# EAGLE schematic ESD_FINAL_SCHEMATICS2 (EAGLE 9.5.0)
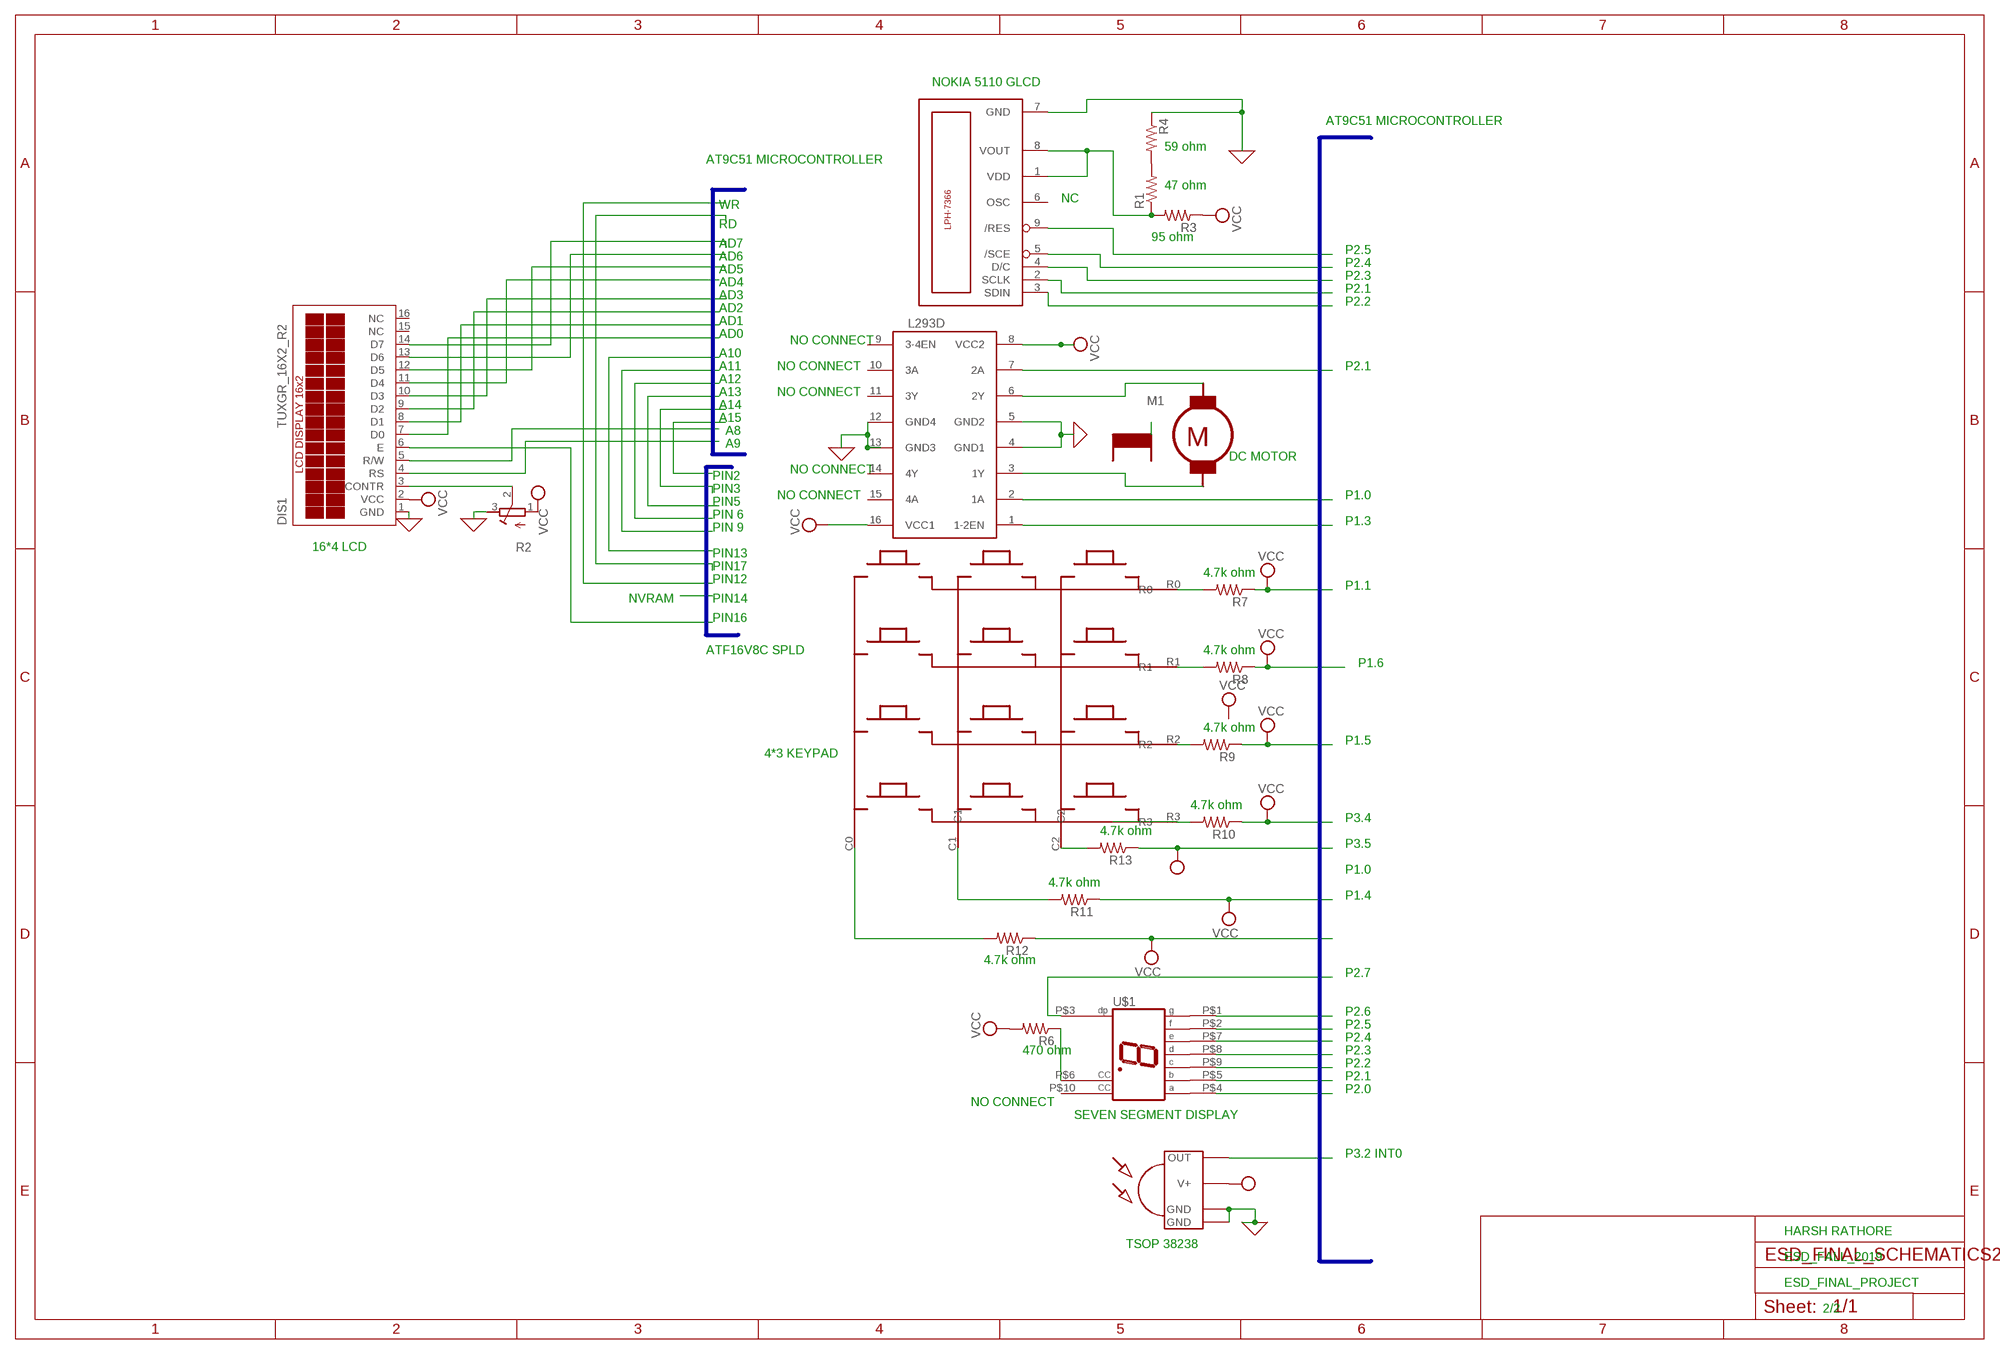
[diagram p0: schematic, sheet 1]

## Parts
DIS1  TUXGR_16X2_R2  [TUXGR_16X2_R2]
IC1  L293D  [DIL16]
KP1  KEYPAD  [KEYPAD]
LCD3  LPH-7366  [LPH-7366]
M1  MOTOR_DC_2_XL  [4PIN]
R1  R-US_0204/2V  [0204V]
R2  R-TRIMM4G/J  [RTRIM4G/J]
R3  R-US_0204/2V  [0204V]
R4  R-US_0204/2V  [0204V]
R6  R-US_0204/2V  [0204V]
R7  R-US_0204/2V  [0204V]
R8  R-US_0204/2V  [0204V]
R9  R-US_0204/2V  [0204V]
R10  R-US_0204/2V  [0204V]
R11  R-US_0204/2V  [0204V]
R12  R-US_0204/2V  [0204V]
R13  R-US_0204/2V  [0204V]
U$1  JUMBOLED  [JUMBOLED]
U$2  TSOP62XX  [TSOP62XX]

## Nets
0: DIS1.1(GND) IC1.4(GND1) IC1.5(GND2) IC1.12(GND4) IC1.13(GND3) LCD3.7(GND) R2.3(E) R4.1 U$2.1(GND) U$2.2(GND) ; supply symbol labelled GND
N$1: DIS1.14(D7)
N$2: DIS1.13(D6)
N$3: DIS1.11(D4)
N$4: DIS1.10(D3)
N$5: DIS1.9(D2)
N$6: DIS1.8(D1)
N$7: DIS1.7(D0)
N$8: DIS1.6(E)
N$9: DIS1.3(CONTR) R2.2(S)
N$15: DIS1.12(D5)
N$18: DIS1.5(R/W)
N$20: DIS1.4(RS)
N$21: LCD3.5(/SCE)
N$22: LCD3.4(D/C)
N$23: LCD3.2(SCLK)
N$24: LCD3.3(SDIN)
N$25: LCD3.9(/RES)
N$26: LCD3.1(VDD) LCD3.8(VOUT) R1.1 R3.2
N$27: R1.2 R4.2
N$28: IC1.7(2A)
N$29: IC1.2(1A)
N$30: IC1.1(1-2EN)
N$31: IC1.6(2Y) M1.2
N$32: IC1.3(1Y) M1.1
N$33: U$2.4(OUT)
N$38: KP1.C1 R11.2
N$39: KP1.C0 R12.2
N$40: U$1.P$1(G)
N$41: U$1.P$2(F)
N$42: U$1.P$7(E)
N$43: U$1.P$8(D)
N$44: U$1.P$9(C)
N$45: U$1.P$5(B)
N$46: U$1.P$4(A)
N$47: R6.1 U$1.P$6(CC)
N$48: U$1.P$3(DP)
N$51: KP1.R0 R7.2
N$52: KP1.R1 R8.2
N$53: KP1.R2 R9.2
N$54: KP1.R3 R10.2
N$57: KP1.C2 R13.2
VCC: DIS1.2(VCC) IC1.8(VCC2) IC1.16(VCC1) R2.1(A) R3.1 R6.2 R7.1 R8.1 R9.1 R10.1 R11.1 R12.1 R13.1 U$2.3(V+)
Unconnected: DIS1.15(NC) DIS1.16(NC) IC1.9(3-4EN) IC1.10(3A) IC1.11(3Y) IC1.14(4Y) IC1.15(4A) LCD3.6(OSC) M1.3 M1.4 U$1.P$10(CC)

## Buses
B$2
B$1
B$3

## Notes on the sheet
- NOKIA 5110 GLCD
- AT9C51 MICROCONTROLLER
- 59 ohm
- AT9C51 MICROCONTROLLER
- 47 ohm
- NC
- WR
- RD
- 95 ohm
- AD7
- P2.5
- AD6
- P2.4
- AD5
- P2.3
- AD4
- P2.1
- AD3
- P2.2
- AD2
- AD1
- AD0
- NO CONNECT
- A10
- A11 | NO CONNECT | P2.1
- A12
- A13 | NO CONNECT
- A14
- A15
- A8
- A9
- DC MOTOR
- NO CONNECT
- PIN2
- PIN3
- NO CONNECT | P1.0
- PIN5
- PIN 6
- P1.3
- PIN 9
- 16*4 LCD
- PIN13
- PIN17
- 4.7k ohm
- PIN12
- P1.1
- NVRAM | PIN14
- PIN16
- ATF16V8C SPLD | 4.7k ohm
- P1.6
- 4.7k ohm
- P1.5
- 4*3 KEYPAD
- 4.7k ohm
- P3.4
- 4.7k ohm
- P3.5
- P1.0
- 4.7k ohm
- P1.4
- 4.7k ohm
- P2.7
- P2.6
- P2.5
- P2.4
- 470 ohm | P2.3
- P2.2
- P2.1
- P2.0
- NO CONNECT
- SEVEN SEGMENT DISPLAY
- P3.2 INT0
- HARSH RATHORE
- TSOP 38238
- ESD_FALL_2019
- ESD_FINAL_PROJECT
- 2/2

## Library data of the parts
DIS1 = display-lcd:TUXGR_16X2_R2: Tuxgraphics LCD display 16x2 characters reflective, without background light Source: tuxgr_12x2_r2.pdf; OC_FARNELL: unknown; OC_NEWARK: unknown
IC1 = st-microelectronics:L293D: PUSH-PULL 4 CHANNEL DRIVER; MPN: L293D; OC_FARNELL: 9589619; OC_NEWARK: 56P8249
KP1 = KeyPad3x4:KEYPAD
LCD3 = lph-7366:LPH-7366
M1 = schule_xl:MOTOR_DC_2_XL
R1 R3 R4 R6-R13 = rcl:R-US_: RESISTOR, American symbol; SPICEPREFIX: R
R2 = rcl:R-TRIMM: Trimm resistor; SPICEMODEL: X; SPICEPREFIXL: POT
U$1 = KeyPad3x4:JUMBOLED
U$2 = tsop-1:TSOP62XX